# Altium schematic sheet Vest.SchDoc
size B; DocumentNumber: 1; SheetNumber: 1; SheetTotal: 4
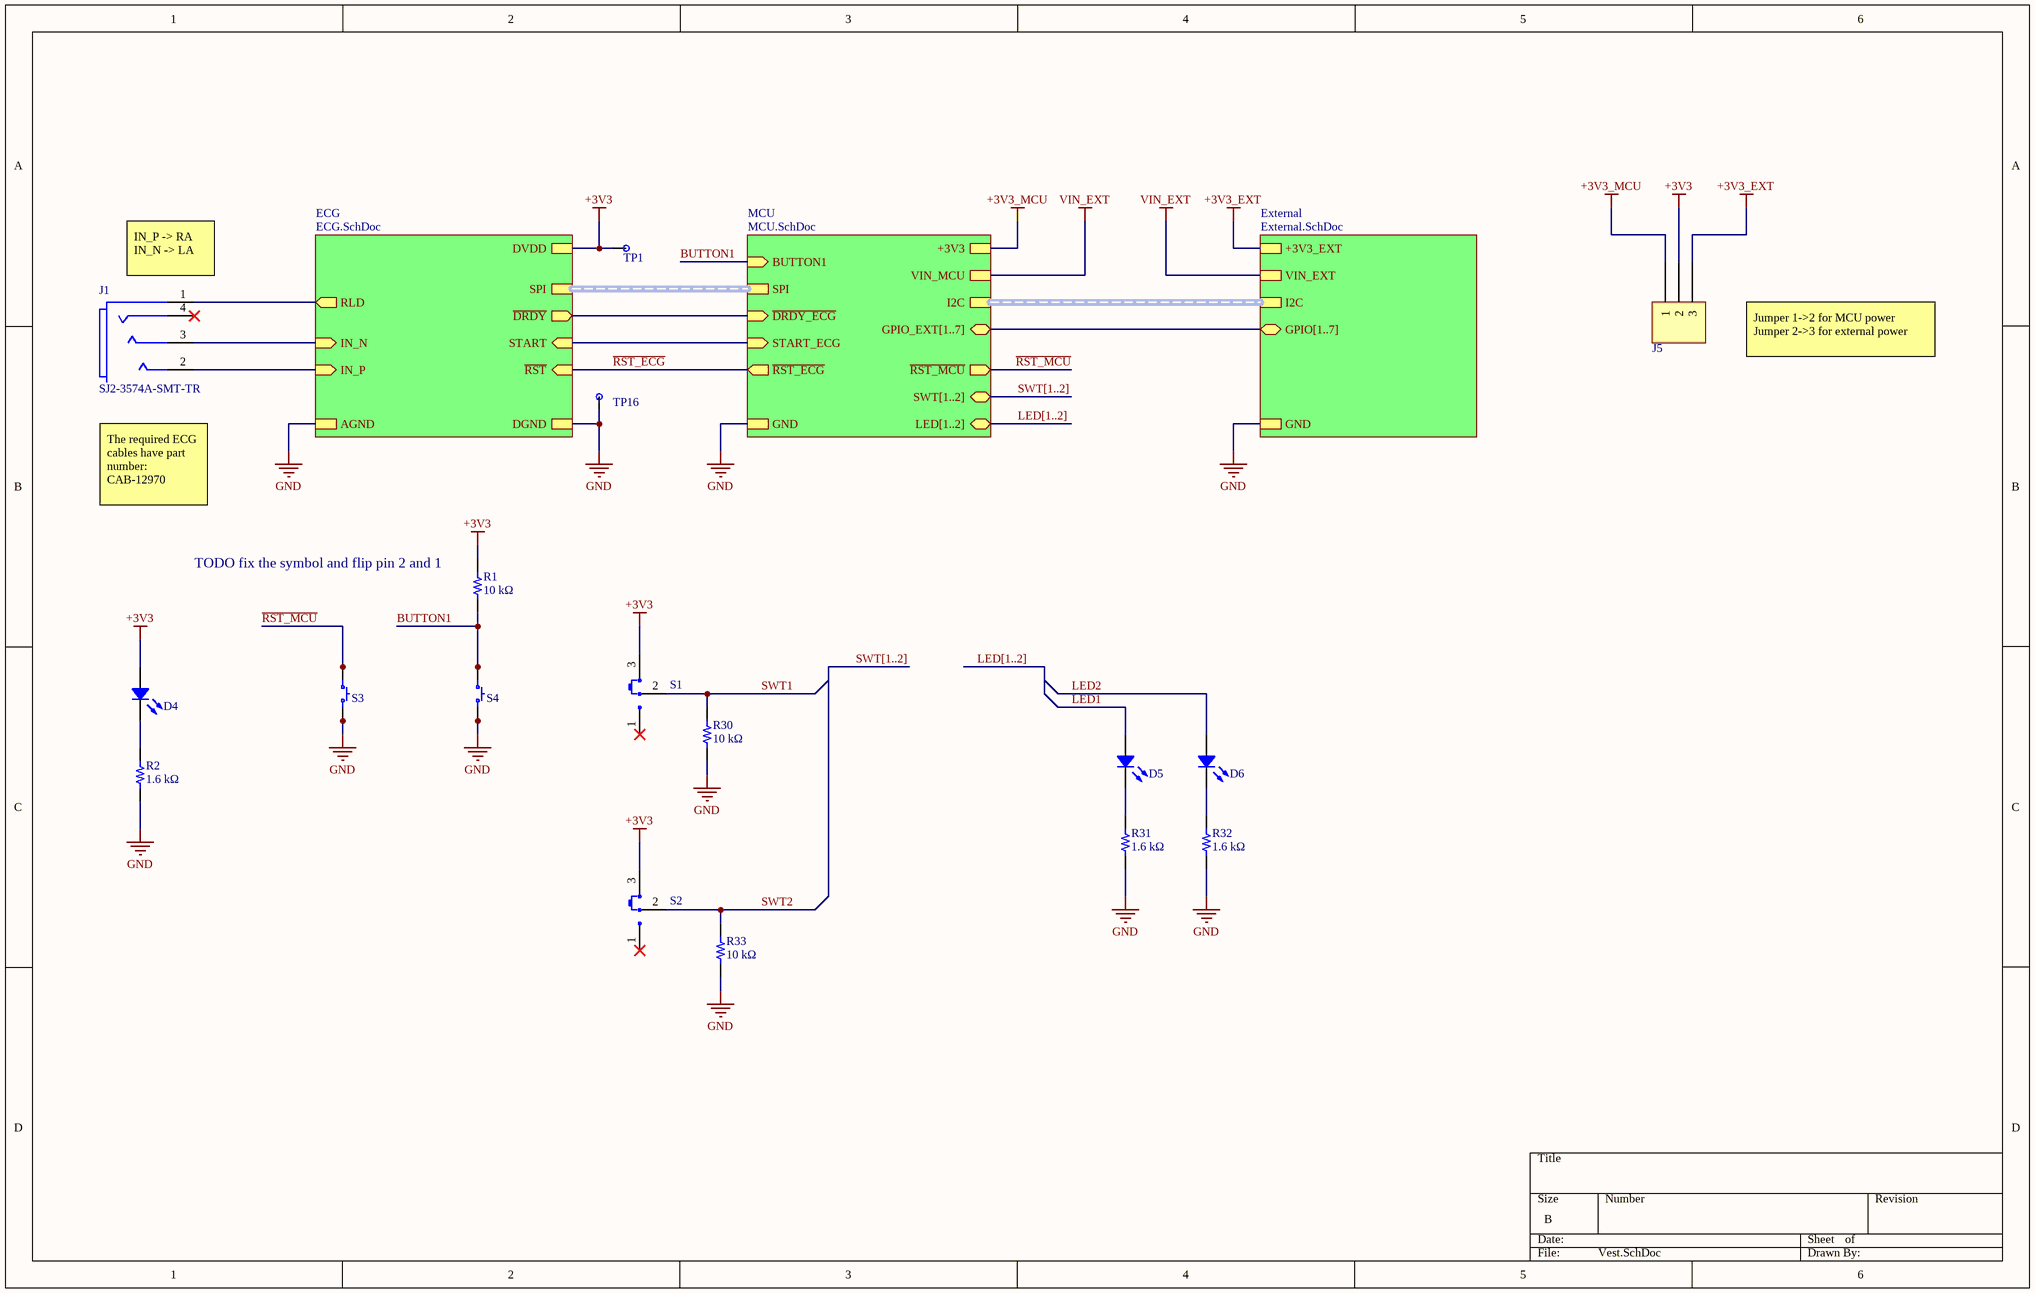
[diagram p0: Vest.SchDoc]

## Parts
D4  Red  [LED 1206_3216 RED]  (value not drawn)
D5  Red  [LED 1206_3216 RED]  (value not drawn)
D6  Red  [LED 1206_3216 RED]  (value not drawn)
J1  SJ2-3574A-SMT-TR  [CUI SJ2-3574A-SMT-TR]
J5  0022272031  [MOLEX KK 0022272031]  (value not drawn)
R1  10 kΩ  [RES 0402_1005]
R2  1.6 kΩ  [RES 0402_1005]
R30  10 kΩ  [RES 0402_1005]
R31  1.6 kΩ  [RES 0402_1005]
R32  1.6 kΩ  [RES 0402_1005]
R33  10 kΩ  [RES 0402_1005]
S1  CUS-12TB  [NCE CUS-12TB]  (value not drawn)
S2  CUS-12TB  [NCE CUS-12TB]  (value not drawn)
S3  1571563-4  [TE FSM4JSMA]  (value not drawn)
S4  1571563-4  [TE FSM4JSMA]  (value not drawn)
TP1  TP2MM  [Test Point 2MM]  (value not drawn)  (no BOM)
TP16  TP2MM  [Test Point 2MM]  (value not drawn)  (no BOM)

## Sub-sheets
ECG = ECG.SchDoc: ~{RST} (in), START (in), ~{DRDY} (out), AGND, DGND, SPI (harness SPI), DVDD, IN_N (in), IN_P (in), RLD (out)
External = External.SchDoc: GND, GPIO[1..7] (bidir), I2C (harness I2C), +3V3_EXT, VIN_EXT
MCU = MCU.SchDoc: ~{RST_ECG} (out), ~{DRDY_ECG} (in), GND, SPI (harness SPI), +3V3, VIN_MCU, START_ECG (in), ~{RST_MCU} (out), I2C (harness I2C), GPIO_EXT[1..7] (bidir), SWT[1..2] (bidir), LED[1..2] (bidir), BUTTON1 (in)

## Nets
+3V3: D4.1 J5.2 R1.1 S1.3 S2.3 TP1.1 ; sheet ECG/DVDD
+3V3_EXT: J5.3 ; sheet External/+3V3_EXT
+3V3_MCU: J5.1 ; sheet MCU/+3V3
GND: R2.1 R30.2 R31.1 R32.1 R33.2 S3.3 S3.4 S4.3 S4.4 TP16.1 ; sheet ECG/AGND, sheet ECG/DGND, sheet MCU/GND, sheet External/GND
VIN_EXT: sheet MCU/VIN_MCU, sheet External/VIN_EXT
BUTTON1: R1.2 S4.1 S4.2 ; sheet MCU/BUTTON1
LED1: D5.1
LED2: D6.1
~{RST_ECG}: sheet ECG/~{RST}, sheet MCU/~{RST_ECG}
~{RST_MCU}: S3.1 S3.2 ; sheet MCU/~{RST_MCU}
SWT1: R30.1 S1.2(COM)
SWT2: R33.1 S2.2(COM)
NetD4_2: D4.2 R2.2
NetD5_2: D5.2 R31.2
NetD6_2: D6.2 R32.2
NetJ1_1: J1.1(sleeve) ; sheet ECG/RLD
NetJ1_2: J1.2(tip) ; sheet ECG/IN_P
NetJ1_3: J1.3(ring_1) ; sheet ECG/IN_N
(unnamed): sheet ECG/START, sheet MCU/START_ECG
(unnamed): sheet ECG/~{DRDY}, sheet MCU/~{DRDY_ECG}

Not connected (* = marked no-connect by the designer): J1 4(ring_2)*; S1 1*; S2 1*

## Buses and harness runs
bus LED[1..2]
bus LED[1..2] = sheet MCU/LED[1..2]
bus sheet External/GPIO[1..7] = sheet MCU/GPIO_EXT[1..7]
bus SWT[1..2]
bus SWT[1..2] = sheet MCU/SWT[1..2]
harness sheet ECG/SPI = sheet MCU/SPI
harness sheet External/I2C = sheet MCU/I2C

## Notes on the sheet
- (near J1) IN_P -> RA
  IN_N -> LA
- Jumper 1->2 for MCU power
  Jumper 2->3 for external power
- The required ECG cables have part number: CAB-12970
- (near R1) TODO fix the symbol and flip pin 2 and 1

## Library data of the parts
D4-D6 = APT3216LSECK/J3-PRV: LED RED CLEAR 2SMD; Manufacturer: Kingbright; Configuration: Standard; Current - Test: 2mA; Lens Color: Colorless; Lens Size: 1.90mm x 1.60mm; Lens Style: Rectangle with Flat Top; Millicandela Rating: 40mcd; Viewing Angle: 120°; Voltage - Forward (Vf) (Typ): 1.8V; Wavelength - Dominant: 625nm; Wavelength - Peak: 640nm; Part Number: APT3216LSECK/J3-PRV; Color: Red; ComponentLink1Description: Datasheet; ComponentLink1URL: http://www.kingbrightusa.com/images/catalog/SPEC/APT3216LSECK-J3-PRV.pdf; ComponentLink2Description: DigiKey Link; ComponentLink2URL: http://digikey.com/product-detail/en/kingbright/APT3216LSECK-J3-PRV/754-1940-1-ND/5177470; Device Package: 1206 (3216 Metric); Height (Max): 0.75mm; LastUpdated: 2020-02-03 5:16:26 PM; Lens Transparency: Clear; Lifecycle Status: Active; Minimum Order: 1; Mounting Type: Surface Mount; Package / Case: 1206 (3216 Metric); Packaging: TapeAndReel; Part Status: Active; Price: 0.16; Series: HELI2; Size / Dimension: 3.20mm L x 1.60mm W; Supplier 1: DigiKey; Supplier Part Number 1: 754-1940-1-ND; Supplier Device Package: 2-SMD; Value: Red
J1 = SJ2-3574A-SMT-TR: AUDIO JACK, 3.5 MM, RT, 4 CONDUC; Manufacturer: CUI Devices; Connector Type: Phone Jack; Gender: Female; Internal Switch(s): Does Not Contain Switch; Mating Length/Depth: 0.551"" (14.00mm); Current Rating: 1A; Shielding: Unshielded; Voltage - Rated: 12VDC; Number of Positions/Contacts: 4 Conductors, 4 Contacts; Part Number: SJ2-3574A-SMT-TR; ComponentLink1Description: Datasheet; ComponentLink1URL: https://www.cuidevices.com/product/resource/digikeypdf/sj2-357x-smt.pdf; ComponentLink2Description: DigiKey Link; ComponentLink2URL: https://www.digikey.com/en/products/detail/cui-devices/SJ2-3574A-SMT-TR/6619530?s=N4IgTCBcDaIMoCkwFoDMBWA7AFgILLgFkAVZYgJRAF0BfIA; Device Package: Tape and Reel; Features: Board Guide; LastUpdated: 2020-08-26 1:45:56 AM; Lifecycle Status: 1; Minimum Order: 1; Mounting Type: Surface Mount, Right Angle; Packaging: Tape and Reel; Part Status: Active; Price: 1.15; Series: SJ2; Supplier 1: DigiKey; Supplier Part Number 1: CP-SJ2-3574A-SMT-TR-ND
J5 = 0022272031: CONN HEADER VERT 3POS 2.54MM; Manufacturer: Molex; Contact Length - Mating: 0.295" (7.49mm); Contact Length - Post: 0.140" (3.56mm); Material Flammability Rating: UL94 V-0; Number of Positions: 3; Number of Positions Loaded: All; Overall Contact Length: 0.560" (14.22mm); Pitch - Mating: 0.100" (2.54mm); Shrouding: Shrouded - 1 Wall; Style: Board to Cable/Wire; Part Number: 0022272031; ComponentLink1Description: Datasheet; ComponentLink1URL: https://www.molex.com/pdm_docs/sd/022272031_sd.pdf; ComponentLink2Description: DigiKey Link; ComponentLink2URL: http://digikey.com/product-detail/en/molex/0022272031/WM4112-ND/1130578; Connector Type: Header; Contact Finish - Mating: Tin; Contact Finish - Post: Tin; Contact Finish Thickness - Mating: 100.0µin (2.54µm); Contact Material: Brass; Contact Shape: Square; Contact Type: Male Pin; Fastening Type: Friction Lock; Insulation Color: Natural; Insulation Height: 0.461" (11.70mm); Insulation Material: Polyamide (PA), Nylon; LastUpdated: 2020-02-03 5:11:43 PM; Lifecycle Status: Active; Minimum Order: 1; Mounting Type: Through Hole; Number of Rows: 1; Packaging: Bulk; Part Status: Active; Price: 0.37; Series: KK 6410; Supplier 1: DigiKey; Supplier Part Number 1: WM4112-ND; Termination: Solder
R1 R30 R33 = AC0402FR-0710KL: RES SMD 10K OHM 1% 1/16W 0402; Manufacturer: Yageo; Power (Watts): 0.063W, 1/16W; Temperature Coefficient: ±100ppm/°C; Value: 10 kOhms; Part Number: AC0402FR-0710KL; ComponentLink1Description: Datasheet; ComponentLink1URL: https://www.yageo.com/upload/media/product/productsearch/datasheet/rchip/PYu-AC_51_RoHS_L_7.pdf; ComponentLink2Description: DigiKey Link; ComponentLink2URL: http://digikey.com/product-detail/en/yageo/AC0402FR-0710KL/YAG3436CT-ND/6006285; Composition: Thick Film; Device Package: 0402 (1005 Metric); Features: Automotive AEC-Q200, Moisture Resistant; Height - Seated (Max): 0.015" (0.37mm); LastUpdated: 2020-02-19 6:28:05 AM; Lifecycle Status: Active; Minimum Order: 1; Number of Terminations: 2; Operating Temperature: -55°C ~ 155°C; Package / Case: 0402 (1005 Metric); Packaging: CutTape; Part Status: Active; Price: 0.10; Ratings: AEC-Q200; Resistance: 10 kΩ; Series: AC; Size / Dimension: 0.039" L x 0.020" W (1.00mm x 0.50mm); Supplier 1: DigiKey; Supplier Part Number 1: YAG3436CT-ND; Supplier Device Package: 0402; Tolerance: ±1%
R2 R31 R32 = CRCW04021K60FKED: RES SMD 1.6K OHM 1% 1/16W 0402; Manufacturer: Vishay Dale; Power (Watts): 0.063W, 1/16W; Temperature Coefficient: ±100ppm/°C; Value: 1.6 kOhms; Part Number: CRCW04021K60FKED; ComponentLink1Description: Datasheet; ComponentLink1URL: http://www.vishay.com/docs/20035/dcrcwe3.pdf; ComponentLink2Description: DigiKey Link; ComponentLink2URL: http://digikey.com/product-detail/en/vishay-dale/CRCW04021K60FKED/541-1.60KLCT-ND/1183144; Composition: Thick Film; Device Package: 0402 (1005 Metric); Features: Automotive AEC-Q200; Height - Seated (Max): 0.016" (0.40mm); LastUpdated: 2020-02-19 6:28:05 AM; Lifecycle Status: Active; Minimum Order: 1; Number of Terminations: 2; Operating Temperature: -55°C ~ 155°C; Package / Case: 0402 (1005 Metric); Packaging: CutTape; Part Status: Active; Price: 0.10; Ratings: AEC-Q200; Resistance: 1.6 kΩ; Series: CRCW; Size / Dimension: 0.039" L x 0.020" W (1.00mm x 0.50mm); Supplier 1: DigiKey; Supplier Part Number 1: 541-1.60KLCT-ND; Supplier Device Package: 0402; Tolerance: ±1%
S1 S2 = CUS-12TB: SWITCH SLIDE SPDT 300MA 4V; Manufacturer: Nidec Copal Electronics; Actuator Length: 1.50mm; Actuator Type: Standard; Contact Timing: Non-Shorting (BBM); Current Rating (Amps): 300mA (DC); Switch Function: On-On; Part Number: CUS-12TB; Circuit: SPDT; ComponentLink1Description: Datasheet; ComponentLink1URL: https://www.nidec-copal-electronics.com/e/catalog/switch/cus.pdf; ComponentLink2Description: DigiKey Link; ComponentLink2URL: https://www.digikey.com/product-detail/en/nidec-copal-electronics/CUS-12TB/563-1102-2-ND/1124222; Contact Finish: Gold; Contact Material: Copper Alloy; LastUpdated: 2020-03-02 6:46:22 AM; Lifecycle Status: Active; Minimum Order: 1; Mounting Type: Surface Mount, Right Angle; Operating Temperature: -20°C ~ 70°C; Packaging: TapeAndReel; Part Status: Active; Price: 0.71; Series: CUS; Supplier 1: DigiKey; Supplier Part Number 1: 563-1102-1-ND; Termination Style: Gull Wing; Voltage Rating - AC: 4V; Voltage Rating - DC: 4V
S3 S4 = 1571563-4: SWITCH TACTILE SPST-NO 0.05A 24V; Manufacturer: TE Connectivity ALCOSWITCH Switches; Actuator Height off PCB, Vertical: 5.00mm; Actuator Orientation: Top Actuated; Actuator Type: Standard; Contact Rating @ Voltage: 0.05A @ 24VDC; Illumination: Non-Illuminated; Operating Force: 260gf; Outline: 6.00mm x 6.00mm; Switch Function: Off-Mom; Part Number: 1571563-4; Circuit: SPST-NO; ComponentLink1Description: Datasheet; ComponentLink1URL: https://www.te.com/commerce/DocumentDelivery/DDEController?Action=srchrtrv&DocNm=1308111-1_SWITCHES_CORE_PROGRAM_CATALOG&DocType=CS&DocLang=English; ComponentLink2Description: DigiKey Link; ComponentLink2URL: http://digikey.com/product-detail/en/te-connectivity-alcoswitch-switches/1571563-4/450-2055-1-ND/4569745; LastUpdated: 2020-12-16 5:46:49 AM; Lifecycle Status: Active; Minimum Order: 1; Mounting Type: Surface Mount; Operating Temperature: -35°C ~ 85°C; Packaging: TapeAndReel; Part Status: Active; Price: 0.16; Series: FSMJSMA; Supplier 1: DigiKey; Supplier Part Number 1: 450-2055-1-ND; Termination Style: Gull Wing
TP1 TP16 = TP2MM: 2MM Circular Test Point; Part Number: TP2MM